# EAGLE schematic vldp-hw-rev03 (EAGLE 6.6.0)

## Sheet 1 of 4
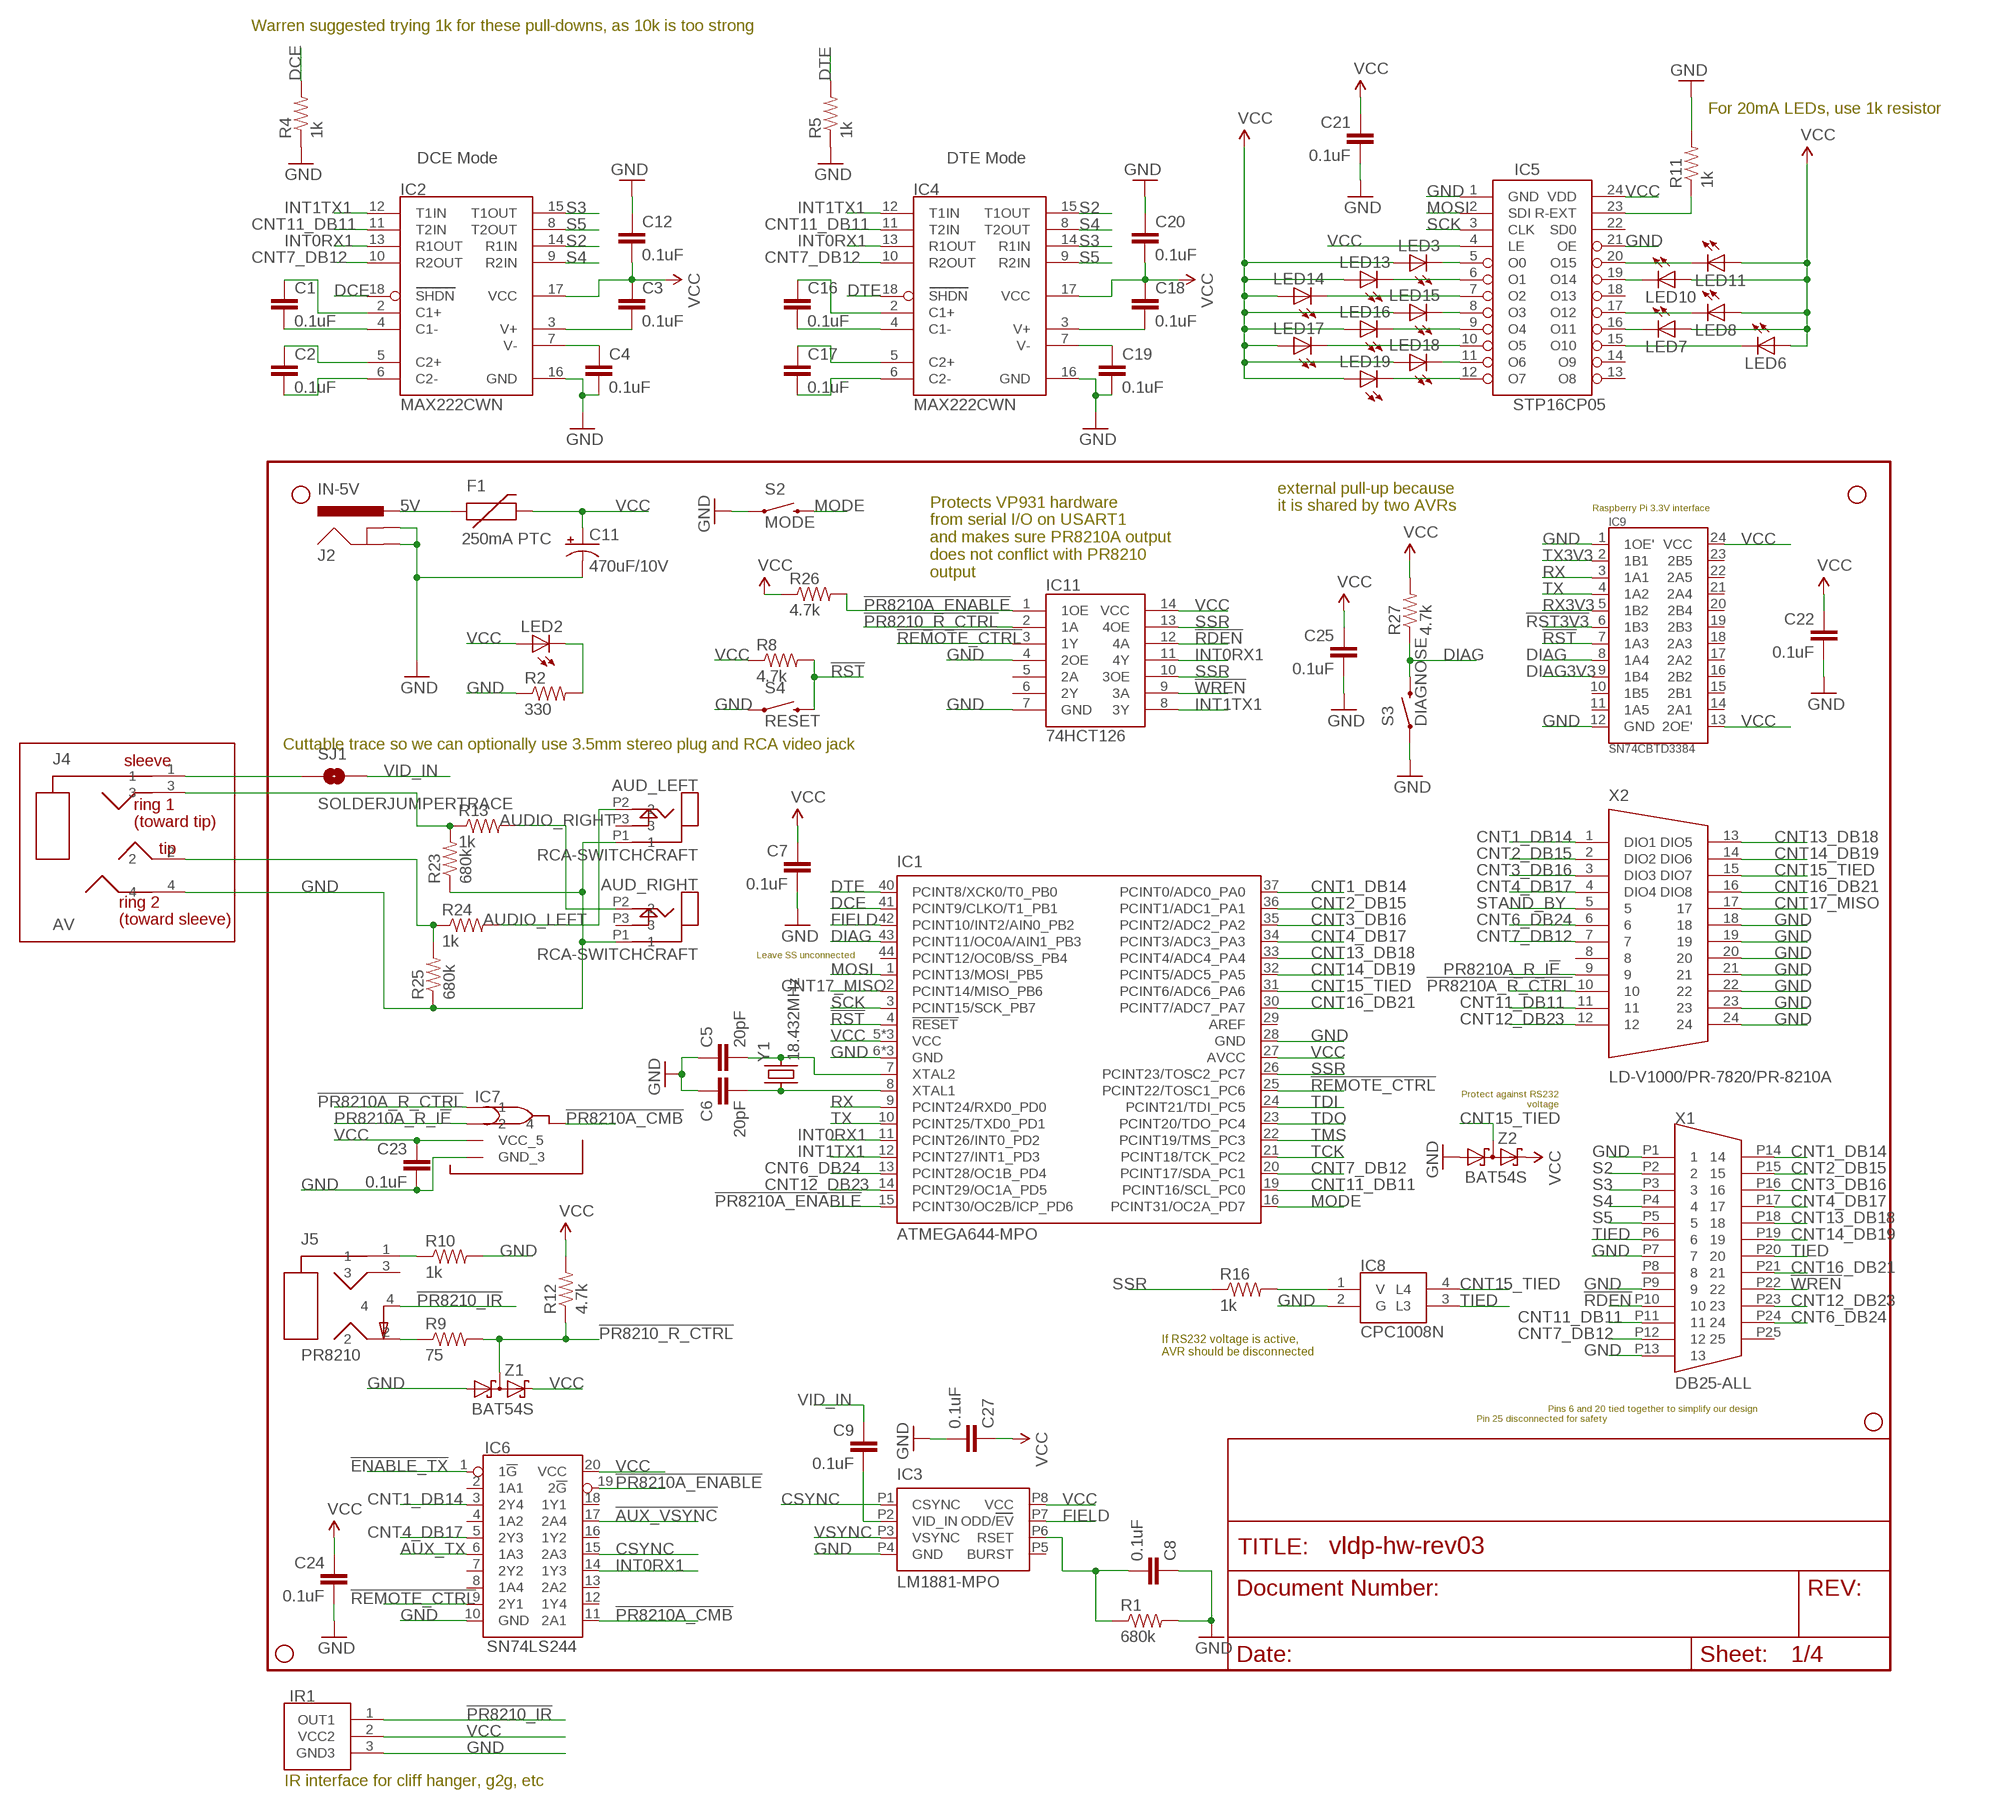
[diagram p0: schematic, sheet 1]

### Parts
AUD_LEFT  RCA-SWITCHCRAFT  [RCA-SWITCHCRAFT-4X]
AUD_RIGHT  RCA-SWITCHCRAFT  [RCA-SWITCHCRAFT-4X]
C1  0.1uF  CAP1206  [1206]
C2  0.1uF  CAP1206  [1206]
C3  0.1uF  CAP1206  [1206]
C4  0.1uF  CAP1206  [1206]
C5  20pF  CAP1206  [1206]
C6  20pF  CAP1206  [1206]
C7  0.1uF  CAP1206  [1206]
C8  0.1uF  CAP1206  [1206]
C9  0.1uF  CAP1206  [1206]
C11  470uF/10V  CAP_POLPTH2  [CPOL-RADIAL-10UF-25V]
C12  0.1uF  CAP1206  [1206]
C16  0.1uF  CAP1206  [1206]
C17  0.1uF  CAP1206  [1206]
C18  0.1uF  CAP1206  [1206]
C19  0.1uF  CAP1206  [1206]
C20  0.1uF  CAP1206  [1206]
C21  0.1uF  CAP1206  [1206]
C22  0.1uF  CAP1206  [1206]
C23  0.1uF  CAP1206  [1206]
C24  0.1uF  CAP1206  [1206]
C25  0.1uF  CAP1206  [1206]
C27  0.1uF  CAP1206  [1206]
F1  250mA PTC  PTCPTH  [PTC]
IC1  ATMEGA644-MPO  [TQFP44]
IC2  MAX222CWN  [SO18]
IC3  LM1881-MPO  [LM1881M]
IC4  MAX222CWN  [SO18]
IC5  STP16CP05  STP16CP05TSSOP24  [TSSOP24]
IC6  SN74LS244  [TSSOP20-MPO]
IC7  PR8210A_RMT  OR_GATE_2INPUT  [TSSOP5]
IC8  CPC1008N  [CPC1008N]
IC9  SN74CBTD3384  [TSSOP24]
IC11  74HCT126  [TSSOP14-MPO]
IR1  TSOP2438  [VISHAY]
J2  IN-5V  POWER_JACKPTH  [POWER_JACK_PTH]
J4  AV  3.5MM-4-TERMINALS  [3.5MM-SJ-43514]
J5  PR8210  3.5MM-STEREO-WITH-TIP-SWITCH  [3.5MM-SJ1-3554NG]
JP1  STAND-OFF  [STAND-OFF]
JP2  STAND-OFF  [STAND-OFF]
JP3  STAND-OFF  [STAND-OFF]
JP4  STAND-OFF  [STAND-OFF]
LED2  LED1206  [LED-1206]
LED3  LED1206  [LED-1206]
LED6  LED1206  [LED-1206]
LED7  LED1206  [LED-1206]
LED8  LED1206  [LED-1206]
LED10  LED1206  [LED-1206]
LED11  LED1206  [LED-1206]
LED13  LED1206  [LED-1206]
LED14  LED1206  [LED-1206]
LED15  LED1206  [LED-1206]
LED16  LED1206  [LED-1206]
LED17  LED1206  [LED-1206]
LED18  LED1206  [LED-1206]
LED19  LED1206  [LED-1206]
R1  680k  RESISTOR1206  [1206]
R2  330  RESISTOR1206  [1206]
R4  1k  RESISTOR1206  [1206]
R5  1k  RESISTOR1206  [1206]
R8  4.7k  RESISTOR1206  [1206]
R9  75  RESISTOR1206  [1206]
R10  1k  RESISTOR1206  [1206]
R11  1k  RESISTOR1206  [1206]
R12  4.7k  RESISTOR1206  [1206]
R13  1k  RESISTOR1206  [1206]
R16  1k  RESISTOR1206  [1206]
R23  680k  RESISTOR1206  [1206]
R24  1k  RESISTOR1206  [1206]
R25  680k  RESISTOR1206  [1206]
R26  4.7k  RESISTOR1206  [1206]
R27  4.7k  RESISTOR1206  [1206]
S2  MODE  SWITCH-MOMENTARY-2PTH  [TACTILE-PTH]
S3  DIAGNOSE  SWITCH-MOMENTARY-2PTH  [TACTILE-PTH]
S4  RESET  SWITCH-MOMENTARY-2PTH  [TACTILE-PTH]
SJ1  SOLDERJUMPERTRACE  [SJ_2S-TRACE]
X1  DB25-ALL  A32077-ND  [A32077-ND]
X2  LD-V1000/PR-7820/PR-8210A  111-024-213L001RIGHTANGLE  [112-YYY-213R001]
Y1  18.432MHz  CRYSTAL  [CRYSTAL-CSM-3X]
Z1  BAT54S  [SOT23]
Z2  BAT54S  [SOT23]

### Nets
5V: F1.P$1 J2.PWR ; also sheet 3
!AUX_VSYNC: IC6.17(2A4) ; also sheet 2,3
!ENABLE_TX: IC6.1(1!G) ; also sheet 2
!PR8210_IR: IR1.1(OUT1) J5.4
!PR8210_R_CTRL: IC11.2(1A) R9.2 R12.1 Z1.3(C1A2)
!PR8210A_CMB: IC6.11(2A1) IC7.P$4
!PR8210A_ENABLE: IC1.15(PCINT30/OC2B/ICP_PD6) IC6.19(2!G) IC11.1(1OE) R26.2
!PR8210A_R_CTRL: IC7.P$1 X2.10
!RDEN: IC11.12(4A) X1.P10
!REMOTE_CTRL: IC1.25(PCINT22/TOSC1_PC6) IC6.9(2Y1) IC11.3(1Y)
!RST: IC1.4(!RESET) IC9.7(1A3) R8.2 S4.3 ; also sheet 2,3
!RST3V3: IC9.6(1B3) ; also sheet 3
!WREN: IC11.9(3A) X1.P22
AUDIO_LEFT: AUD_LEFT.P2 R24.2 ; also sheet 3
AUDIO_RIGHT: AUD_RIGHT.P2 R13.2 ; also sheet 3
AUX_TX: IC6.6(1A3) ; also sheet 2
CNT1_DB14: IC1.37(PCINT0/ADC0_PA0) IC6.3(2Y4) X1.P14 X2.1(DIO1)
CNT2_DB15: IC1.36(PCINT1/ADC1_PA1) X1.P15 X2.2(DIO2)
CNT3_DB16: IC1.35(PCINT2/ADC2_PA2) X1.P16 X2.3(DIO3)
CNT4_DB17: IC1.34(PCINT3/ADC3_PA3) IC6.5(2Y3) X1.P17 X2.4(DIO4)
CNT6_DB24: IC1.13(PCINT28/OC1B_PD4) X1.P24 X2.6 ; also sheet 2,3
CNT7_DB12: IC1.20(PCINT17/SDA_PC1) IC2.10(R2OUT) IC4.10(R2OUT) X1.P12 X2.7
CNT11_DB11: IC1.19(PCINT16/SCL_PC0) IC2.11(T2IN) IC4.11(T2IN) X1.P11 X2.11 ; also sheet 2,3
CNT12_DB23: IC1.14(PCINT29/OC1A_PD5) X1.P23 X2.12 ; also sheet 2,3
CNT13_DB18: IC1.33(PCINT4/ADC4_PA4) X1.P18 X2.13(DIO5)
CNT14_DB19: IC1.32(PCINT5/ADC5_PA5) X1.P19 X2.14(DIO6)
CNT15_TIED: IC1.31(PCINT6/ADC6_PA6) IC8.4(L4) X2.15(DIO7) Z2.3(C1A2)
CNT16_DB21: IC1.30(PCINT7/ADC7_PA7) X1.P21 X2.16(DIO8)
CNT17_MISO: IC1.2(PCINT14/MISO_PB6) X2.17 ; also sheet 3
CSYNC: IC3.P1(CSYNC) IC6.15(2A3) ; also sheet 2,3
DCE: IC1.41(PCINT9/CLKO/T1_PB1) IC2.18(SHDN) R4.2 ; also sheet 2
DIAG: IC1.43(PCINT11/OC0A/AIN1_PB3) IC9.8(1A4) R27.1 S3.3 ; also sheet 2,3
DIAG3V3: IC9.9(1B4) ; also sheet 3
DTE: IC1.40(PCINT8/XCK0/T0_PB0) IC4.18(SHDN) R5.2 ; also sheet 2
FIELD: IC1.42(PCINT10/INT2/AIN0_PB2) IC3.P7(ODD/EV) ; also sheet 2,3
GND: AUD_LEFT.P1 AUD_RIGHT.P1 C4.2 C5.1 C6.1 C7.2 C8.1 C11.2(-) C12.1 C19.2 C20.1 C21.2 C22.2 C23.2 C24.2 C25.2 C27.2 IC1.6(GND) IC1.18(GND) IC1.28(GND) IC1.39(GND) IC2.16(GND) IC3.P4(GND) IC4.16(GND) IC5.1(GND) IC5.21(OE) IC6.10(GND) IC7.P$3(GND_3) IC8.2(G) IC9.1(1OE') IC9.12(GND) IC11.4(2OE) IC11.7(GND) IR1.3(GND3) J2.GND J2.GNDBREAK J4.4 R1.2 R2.1 R4.1 R5.1 R10.2 R11.2 R23.1 R25.1 S2.1 S3.1 S4.1 X1.P1 X1.P7 X1.P9 X1.P13 X2.18 X2.19 X2.20 X2.21 X2.22 X2.23 X2.24 Z1.1(A1) Z2.1(A1) ; also sheet 2,3
INT0RX1: IC1.11(PCINT26/INT0_PD2) IC2.13(R1OUT) IC4.13(R1OUT) IC6.14(1Y3) IC11.11(4Y) ; also sheet 3
INT1TX1: IC1.12(PCINT27/INT1_PD3) IC2.12(T1IN) IC4.12(T1IN) IC11.8(3Y) ; also sheet 2,3
MODE: IC1.16(PCINT31/OC2A_PD7) S2.3
MOSI: IC1.1(PCINT13/MOSI_PB5) IC5.2(SDI) ; also sheet 3
N$2: C2.1 IC2.5(C2+)
N$3: C5.2 IC1.7(XTAL2) Y1.P$2
N$4: C6.2 IC1.8(XTAL1) Y1.P$1
N$5: C1.2 IC2.4(C1-)
N$6: C1.1 IC2.2(C1+)
N$7: IC8.1(V) R16.2
N$8: C2.2 IC2.6(C2-)
N$9: C16.2 IC4.4(C1-)
N$10: J5.1 R10.1
N$11: C8.2 IC3.P6(RSET) R1.1
N$13: C9.2 IC3.P2(VID_IN)
N$16: LED2.C R2.2
N$18: J4.1 SJ1.1
N$21: J4.2 R24.1 R25.2
N$22: IC5.5(O0) LED3.C
N$23: IC5.6(O1) LED13.C
N$24: IC5.7(O2) LED14.C
N$25: IC5.8(O3) LED15.C
N$26: C16.1 IC4.2(C1+)
N$27: C17.1 IC4.5(C2+)
N$28: C17.2 IC4.6(C2-)
N$29: IC5.9(O4) LED16.C
N$30: IC5.10(O5) LED17.C
N$31: IC5.11(O6) LED18.C
N$32: IC5.12(O7) LED19.C
N$33: J4.3 R13.1 R23.2
N$35: IC5.15(O10) LED6.C
N$36: IC5.16(O11) LED7.C
N$37: IC5.17(O12) LED8.C
N$39: IC5.19(O14) LED10.C
N$40: IC5.20(O15) LED11.C
N$41: IC5.23(R-EXT) R11.1
PR8210_TIP: J5.2 R9.1
PR8210A_R_I!E: IC7.P$2 X2.9
RX: IC1.9(PCINT24/RXD0_PD0) IC9.3(1A1) ; also sheet 3
RX3V3: IC9.5(1B2) ; also sheet 3
S2: IC2.14(R1IN) IC4.15(T1OUT) X1.P2
S3: IC2.15(T1OUT) IC4.14(R1IN) X1.P3
S4: IC2.9(R2IN) IC4.8(T2OUT) X1.P4
S5: IC2.8(T2OUT) IC4.9(R2IN) X1.P5
SCK: IC1.3(PCINT15/SCK_PB7) IC5.3(CLK) ; also sheet 3
SSR: IC1.26(PCINT23/TOSC2_PC7) IC11.10(3OE) IC11.13(4OE) R16.1 ; also sheet 2
STAND_BY: X2.5 ; also sheet 2,3
TCK: IC1.21(PCINT18/TCK_PC2) ; also sheet 3
TDI: IC1.24(PCINT21/TDI_PC5) ; also sheet 3
TDO: IC1.23(PCINT20/TDO_PC4) ; also sheet 3
TIED: IC8.3(L3) X1.P6 X1.P20
TMS: IC1.22(PCINT19/TMS_PC3) ; also sheet 3
TX: IC1.10(PCINT25/TXD0_PD1) IC9.4(1A2) ; also sheet 3
TX3V3: IC9.2(1B1) ; also sheet 3
V+1: C3.2 IC2.3(V+)
V+2: C18.2 IC4.3(V+)
V-1: C4.1 IC2.7(V-)
V-2: C19.1 IC4.7(V-)
VCC: C3.1 C7.1 C11.1(+) C12.2 C18.1 C20.2 C21.1 C22.1 C23.1 C24.1 C25.1 C27.1 F1.P$2 IC1.5(VCC) IC1.17(VCC) IC1.27(AVCC) IC1.38(VCC) IC2.17(VCC) IC3.P8(VCC) IC4.17(VCC) IC5.4(LE) IC5.24(VDD) IC6.20(VCC) IC7.P$5(VCC_5) IC9.13(2OE') IC9.24(VCC) IC11.14(VCC) IR1.2(VCC2) LED2.A LED3.A LED6.A LED7.A LED8.A LED10.A LED11.A LED13.A LED14.A LED15.A LED16.A LED17.A LED18.A LED19.A R8.1 R12.2 R26.1 R27.2 Z1.2(C2) Z2.2(C2) ; also sheet 2,3
VID_IN: C9.1 SJ1.2 ; also sheet 2
VSYNC: IC3.P3(VSYNC) ; also sheet 3
Unconnected: AUD_LEFT.P3 AUD_RIGHT.P3 IC1.29(AREF) IC1.44(PCINT12/OC0B/SS_PB4) IC3.P5(BURST) IC5.13(O8) IC5.14(O9) IC5.18(O13) IC5.22(SD0) IC6.2(1A1) IC6.4(1A2) IC6.7(2Y2) IC6.8(1A4) IC6.12(1Y4) IC6.13(2A2) IC6.16(1Y2) IC6.18(1Y1) IC9.10(1B5) IC9.11(1A5) IC9.14(2A1) IC9.15(2B1) IC9.16(2B2) IC9.17(2A2) IC9.18(2A3) IC9.19(2B3) IC9.20(2B4) IC9.21(2A4) IC9.22(2A5) IC9.23(2B5) IC11.5(2A) IC11.6(2Y) J5.3 X1.P8 X1.P25 X2.8

### Notes on the sheet
- Warren suggested trying 1k for these pull-downs, as 10k is too strong
- For 20mA LEDs, use 1k resistor
- DCE Mode | DTE Mode
- external pull-up because
  it is shared by two AVRs
- Raspberry Pi 3.3V interface
- Protects VP931 hardware
  from serial I/O on USART1
  and makes sure PR8210A output
  does not conflict with PR8210
  output
- Cuttable trace so we can optionally use 3.5mm stereo plug and RCA video jack
- Leave SS unconnected
- Protect against RS232
  voltage
- If RS232 voltage is active,
  AVR should be disconnected
- Pins 6 and 20 tied together to simplify our design
- Pin 25 disconnected for safety
- IR interface for cliff hanger, g2g, etc

## Sheet 2 of 4
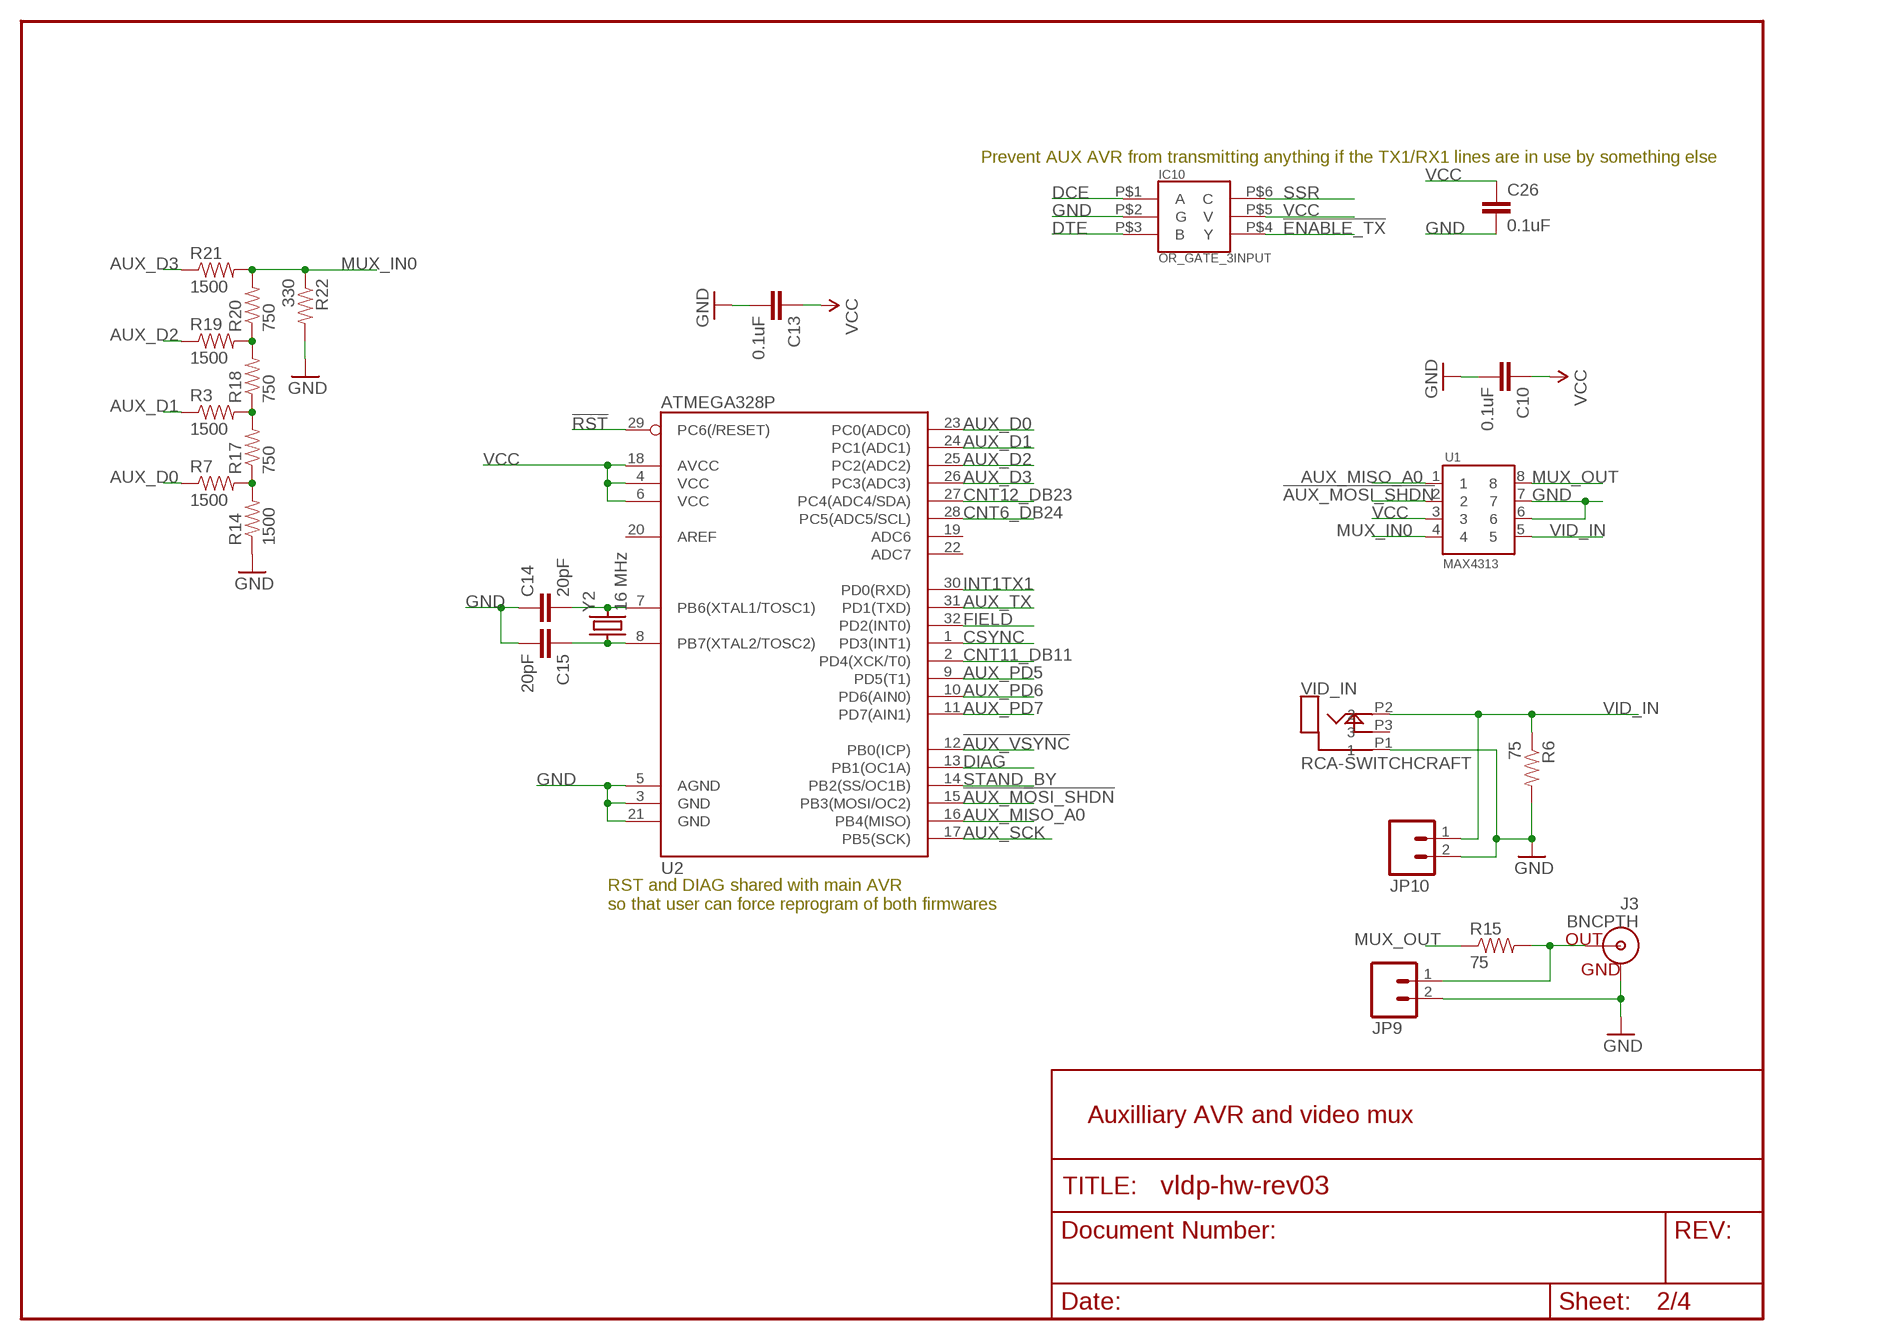
[diagram p1: schematic, sheet 2]

### Parts
C10  0.1uF  CAP1206  [1206]
C13  0.1uF  CAP1206  [1206]
C14  20pF  CAP1206  [1206]
C15  20pF  CAP1206  [1206]
C26  0.1uF  CAP1206  [1206]
IC10  OR_GATE_3INPUT  [TSSOP6-DCK]
J3  BNCPTH  [BNC]
JP9  M02PTH  [1X02]
JP10  M02PTH  [1X02]
R3  1500  RESISTOR1206  [1206]
R6  75  RESISTOR1206  [1206]
R7  1500  RESISTOR1206  [1206]
R14  1500  RESISTOR1206  [1206]
R15  75  RESISTOR1206  [1206]
R17  750  RESISTOR1206  [1206]
R18  750  RESISTOR1206  [1206]
R19  1500  RESISTOR1206  [1206]
R20  750  RESISTOR1206  [1206]
R21  1500  RESISTOR1206  [1206]
R22  330  RESISTOR1206  [1206]
U1  MAX4313  MAX4313UMAX  [MAXIM-UMAX-LONGPADS]
U2  ATMEGA328P  ATMEGA168  [TQFP32-LONGPADS]
VID_IN  RCA-SWITCHCRAFT  [RCA-SWITCHCRAFT-4X]
Y2  16 MHz  CRYSTAL  [CRYSTAL-CSM-3X]

### Nets
!AUX_MOSI_SHDN: U1.2 U2.15(PB3(MOSI/OC2)) ; also sheet 3
!AUX_VSYNC: U2.12(PB0(ICP)) ; also sheet 1,3
!ENABLE_TX: IC10.P$4(Y) ; also sheet 1
!RST: U2.29(PC6(/RESET)) ; also sheet 1,3
AUX_D0: R7.1 U2.23(PC0(ADC0))
AUX_D1: R3.1 U2.24(PC1(ADC1))
AUX_D2: R19.1 U2.25(PC2(ADC2))
AUX_D3: R21.1 U2.26(PC3(ADC3))
AUX_MISO_A0: U1.1 U2.16(PB4(MISO)) ; also sheet 3
AUX_PD5: U2.9(PD5(T1)) ; also sheet 3
AUX_PD6: U2.10(PD6(AIN0)) ; also sheet 3
AUX_PD7: U2.11(PD7(AIN1)) ; also sheet 3
AUX_SCK: U2.17(PB5(SCK)) ; also sheet 3
AUX_TX: U2.31(PD1(TXD)) ; also sheet 1
CNT6_DB24: U2.28(PC5(ADC5/SCL)) ; also sheet 1,3
CNT11_DB11: U2.2(PD4(XCK/T0)) ; also sheet 1,3
CNT12_DB23: U2.27(PC4(ADC4/SDA)) ; also sheet 1,3
CSYNC: U2.1(PD3(INT1)) ; also sheet 1,3
DCE: IC10.P$1(A) ; also sheet 1
DIAG: U2.13(PB1(OC1A)) ; also sheet 1,3
DTE: IC10.P$3(B) ; also sheet 1
FIELD: U2.32(PD2(INT0)) ; also sheet 1,3
GND: C10.2 C13.2 C14.1 C15.2 C26.2 IC10.P$2(G) J3.GND JP9.2 JP10.2 R6.2 R14.1 R22.2 U1.6 U1.7 U2.3(GND) U2.5(AGND) U2.21(GND) VID_IN.P1 ; also sheet 1,3
INT1TX1: U2.30(PD0(RXD)) ; also sheet 1,3
MUX_IN0: R20.2 R21.2 R22.1 U1.4
MUX_OUT: R15.1 U1.8
N$1: J3.S(OUT) JP9.1 R15.2
N$12: R3.2 R17.2 R18.1
N$14: R7.2 R14.2 R17.1
N$15: R18.2 R19.2 R20.1
N$17: C14.2 U2.7(PB6(XTAL1/TOSC1)) Y2.P$2
N$19: C15.1 U2.8(PB7(XTAL2/TOSC2)) Y2.P$1
SSR: IC10.P$6(C) ; also sheet 1
STAND_BY: U2.14(PB2(SS/OC1B)) ; also sheet 1,3
VCC: C10.1 C13.1 C26.1 IC10.P$5(V) U1.3 U2.4(VCC) U2.6(VCC) U2.18(AVCC) ; also sheet 1,3
VID_IN: JP10.1 R6.1 U1.5 VID_IN.P2 ; also sheet 1
Unconnected: U2.19(ADC6) U2.20(AREF) U2.22(ADC7) VID_IN.P3

### Notes on the sheet
- Prevent AUX AVR from transmitting anything if the TX1/RX1 lines are in use by something else
- RST and DIAG shared with main AVR
  so that user can force reprogram of both firmwares
- Auxilliary AVR and video mux

## Sheet 3 of 4
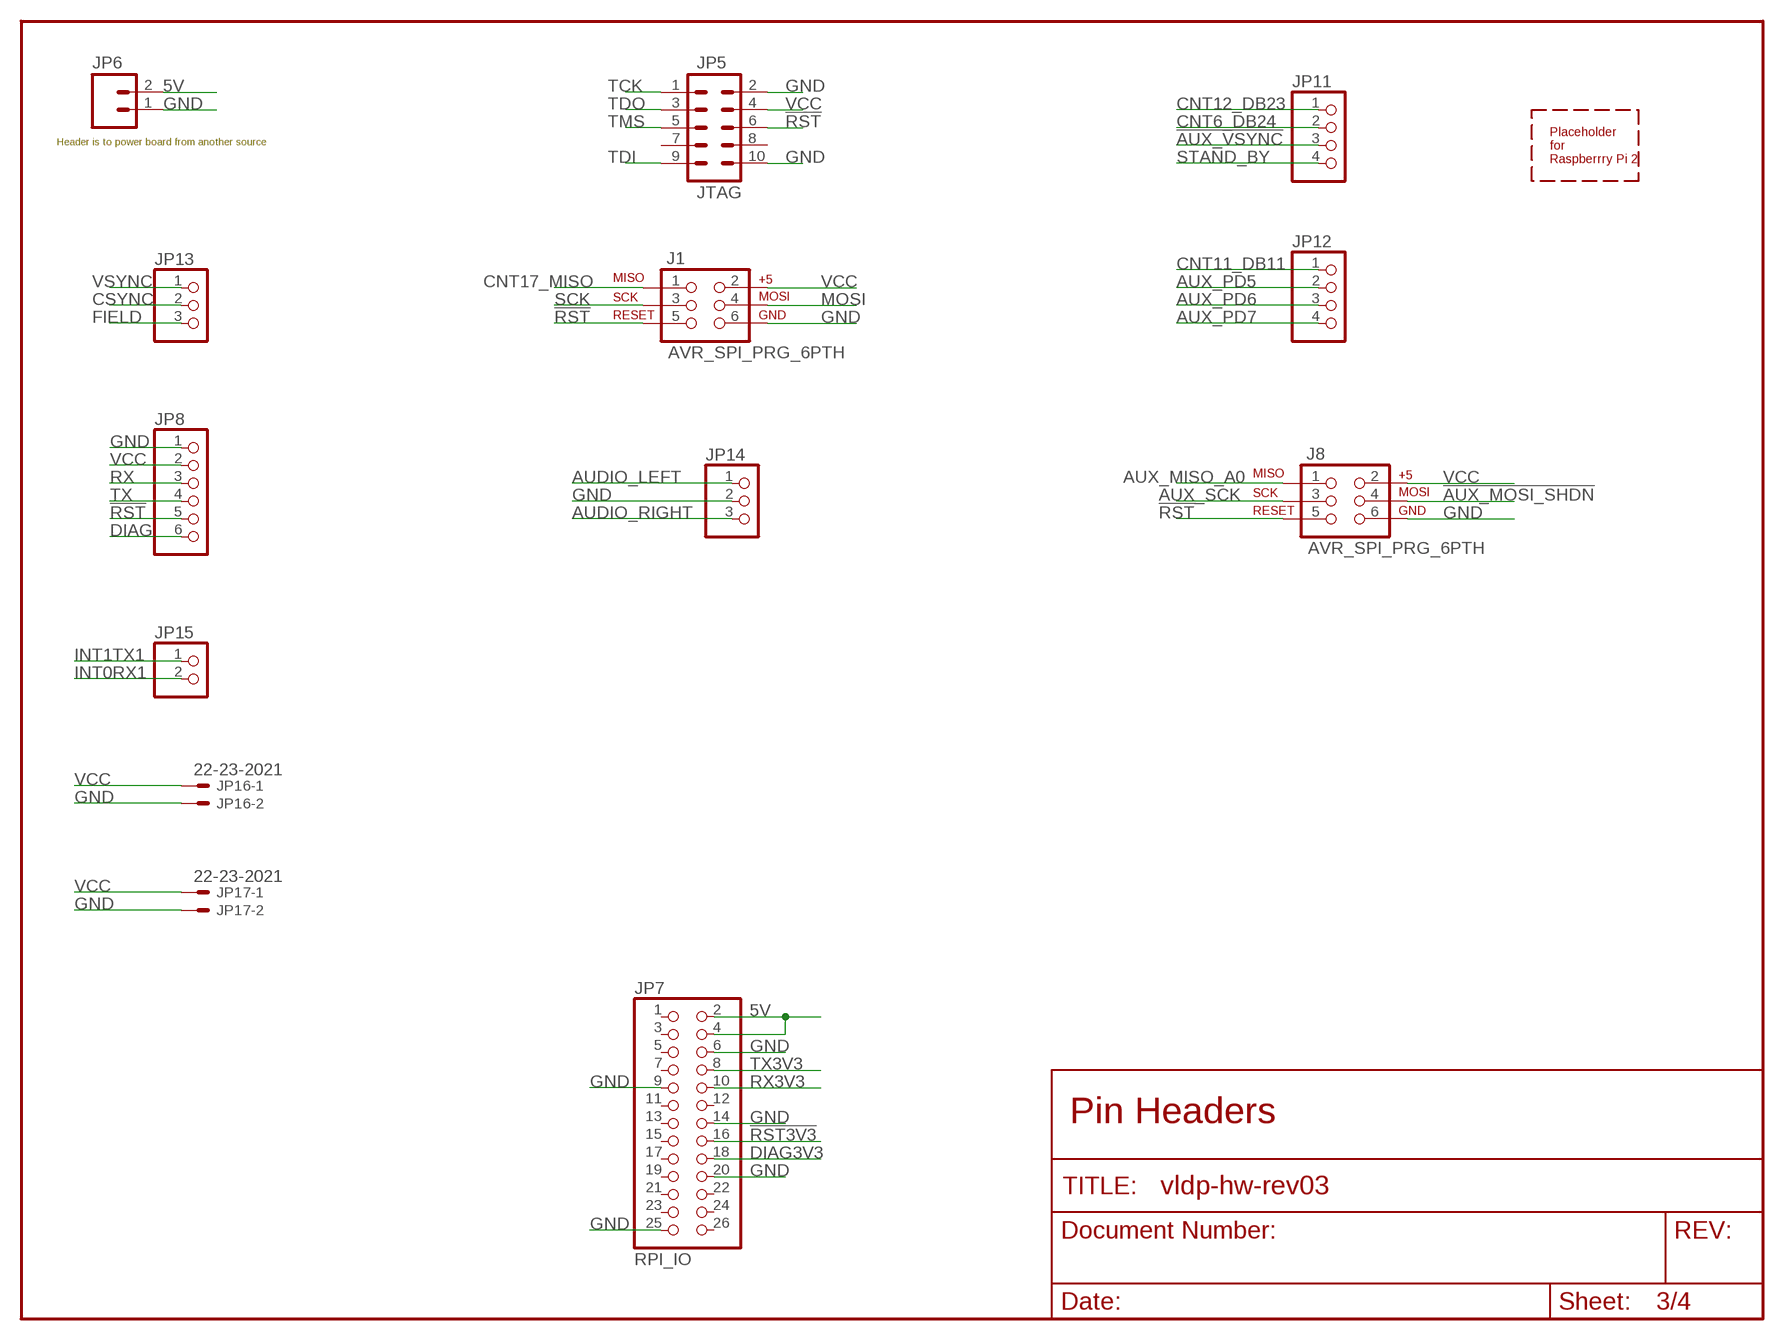
[diagram p2: schematic, sheet 3]

### Parts
J1  AVR_SPI_PRG_6PTH  [2X3]
J8  AVR_SPI_PRG_6PTH  [2X3]
JP5  JTAG  M05X2PTH  [AVR_ICSP]
JP6  M02PTH  [1X02]
JP7  RPI_IO  PINHD-2X13  [2X13]
JP8  PINHD-1X6  [1X06]
JP11  PINHD-1X4  [1X04]
JP12  PINHD-1X4  [1X04]
JP13  PINHD-1X3  [1X03]
JP14  PINHD-1X3  [1X03]
JP15  PINHD-1X2  [1X02]
JP16  22-23-2021  [22-23-2021]
JP17  22-23-2021  [22-23-2021]
U$1  RASPBERRY_PI2_LAYOUT  [RPI2]

### Nets
5V: JP6.2 JP7.2 JP7.4 ; also sheet 1
!AUX_MOSI_SHDN: J8.4 ; also sheet 2
!AUX_VSYNC: JP11.3 ; also sheet 1,2
!RST: J1.5 J8.5 JP5.6 JP8.5 ; also sheet 1,2
!RST3V3: JP7.16 ; also sheet 1
AUDIO_LEFT: JP14.1 ; also sheet 1
AUDIO_RIGHT: JP14.3 ; also sheet 1
AUX_MISO_A0: J8.1 ; also sheet 2
AUX_PD5: JP12.2 ; also sheet 2
AUX_PD6: JP12.3 ; also sheet 2
AUX_PD7: JP12.4 ; also sheet 2
AUX_SCK: J8.3 ; also sheet 2
CNT6_DB24: JP11.2 ; also sheet 1,2
CNT11_DB11: JP12.1 ; also sheet 1,2
CNT12_DB23: JP11.1 ; also sheet 1,2
CNT17_MISO: J1.1 ; also sheet 1
CSYNC: JP13.2 ; also sheet 1,2
DIAG: JP8.6 ; also sheet 1,2
DIAG3V3: JP7.18 ; also sheet 1
FIELD: JP13.3 ; also sheet 1,2
GND: J1.6 J8.6 JP5.2 JP5.10 JP6.1 JP7.6 JP7.9 JP7.14 JP7.20 JP7.25 JP8.1 JP14.2 JP16.2 JP17.2 ; also sheet 1,2
INT0RX1: JP15.2 ; also sheet 1
INT1TX1: JP15.1 ; also sheet 1,2
MOSI: J1.4 ; also sheet 1
RX: JP8.3 ; also sheet 1
RX3V3: JP7.10 ; also sheet 1
SCK: J1.3 ; also sheet 1
STAND_BY: JP11.4 ; also sheet 1,2
TCK: JP5.1 ; also sheet 1
TDI: JP5.9 ; also sheet 1
TDO: JP5.3 ; also sheet 1
TMS: JP5.5 ; also sheet 1
TX: JP8.4 ; also sheet 1
TX3V3: JP7.8 ; also sheet 1
VCC: J1.2 J8.2 JP5.4 JP8.2 JP16.1 JP17.1 ; also sheet 1,2
VSYNC: JP13.1 ; also sheet 1
Unconnected: JP5.7 JP5.8 JP7.1 JP7.3 JP7.5 JP7.7 JP7.11 JP7.12 JP7.13 JP7.15 JP7.17 JP7.19 JP7.21 JP7.22 JP7.23 JP7.24 JP7.26

### Notes on the sheet
- Header is to power board from another source
- Pin Headers

## Sheet 4 of 4

## Library data of the parts
AUD_LEFT AUD_RIGHT VID_IN = mpo:RCA-SWITCHCRAFT
C1-C10 C12-C27 = SparkFun:CAP: Capacitor Standard 0603 ceramic capacitor, and 0.1" leaded capacitor.
C11 = SparkFun:CAP_POL: Capacitor Polarized These are standard SMD and PTH capacitors. Normally 10uF, 47uF, and 100uF in electrolytic and tantalum varieties. Always verify the external diameter of the through hole cap, it varies with capacity, voltage, and manufacturer. The EIA devices should be standard.
F1 = SparkFun:PTC: Resettable Fuse PTC Resettable Fuse. Spark Fun Electronics SKU : COM-08357
IC1 = mpo:ATMEGA644-MPO
IC2 IC4 = mpo:MAX222CWN: MAX222CWN
IC3 = mpo:LM1881-MPO
IC5 = mpo:STP16CP05
IC6 = mpo:SN74LS244
IC7 = mpo:OR_GATE_2INPUT
IC8 = mpo:CPC1008N: CPC1008N
IC9 = mpo:SN74CBTD3384
IC10 = mpo:OR_GATE_3INPUT
IC11 = mpo:74HCT126
IR1 = mpo:TSOP2438
J1 J8 = SparkFun:AVR_SPI_PRG_6: AVR ISP 6 Pin This is the reduced ISP connector for AVR programming. Common on Arduino. This footprint will take up less PCB space and can be used with a 10-pin to 6-pin adapter such as SKU: BOB-08508
J2 = SparkFun:POWER_JACK: Power Jack This is the standard 5.5mm barrel jack for power. The PTH is the most common, proven, reliable, footprint. All others are experimental. The Slot footprint only works if the mill layer is transmitted to the PCB fab house so be warned. Spark Fun Electronics SKU : PRT-00119. Mating wall wart : TOL-00298 (and others)
J3 = SparkFun:BNC: BNC Connector, Mouser Part# 5227161
J4 = mpo:3.5MM-4-TERMINALS
J5 = mpo:3.5MM-STEREO-WITH-TIP-SWITCH
JP1-JP4 = SparkFun:STAND-OFF: Stand Off This is the mechanical footprint for a #4 phillips button head screw. Use the keepout ring to avoid running the screw head into surrounding components. SKU : PRT-00447
JP5 = SparkFun:M05X2: Header 5x2 Standard 10-pin dual row 0.1" header. Commonly used with AVR-ISP. Use with Spark Fun Electronics SKU: PRT-00778
JP6 JP9 JP10 = SparkFun:M02: Header 2 Standard 2-pin 0.1" header. Use with straight break away headers (SKU : PRT-00116), right angle break away headers (PRT-00553), swiss pins (PRT-00743), machine pins (PRT-00117), and female headers (PRT-00115). Molex polarized connector foot print use with SKU : PRT-08233 with associated crimp pins and housings.
JP7 = pinhead:PINHD-2X13: PIN HEADER
JP8 = pinhead:PINHD-1X6: PIN HEADER
JP11 JP12 = pinhead:PINHD-1X4: PIN HEADER
JP13 JP14 = pinhead:PINHD-1X3: PIN HEADER
JP15 = pinhead:PINHD-1X2: PIN HEADER
JP16 JP17 = con-molex:22-23-2021: .100" (2.54mm) Center Header - 2 Pin; MF: MOLEX; MPN: 22-23-2021; OC_FARNELL: 1462926; OC_NEWARK: 25C3832
LED2 LED3 LED6-LED8 LED10 LED11 LED13-LED19 = SparkFun:LED: LEDs Standard schematic elements and footprints for 5mm, 3mm, 1206, and 0603 sized LEDs. 5mm - Spark Fun Electronics SKU : COM-00529 (and others)
R1-R27 = SparkFun:RESISTOR: Resistor Basic schematic elements and footprints for 0603, 1206, and PTH resistors.
S2-S4 = SparkFun:SWITCH-MOMENTARY-2
SJ1 = SparkFun:SOLDERJUMPER: Solder Jumper Standard SMD solder jumper. Used to automate production. Two varients : Normally Open and Normally Closed are the same, but have different paste layers. NC will have a large amount of paste and should jumper during reflow.
U1 = mpo:MAX4313
U2 = mpo:ATMEGA168
U$1 = mpo:RASPBERRY_PI2_LAYOUT
X1 = mpo:A32077-ND: DB2 female right-angle Digikey A32077-ND
X2 = mpo:111-024-213L001: LD-V1000 connector
Y1 Y2 = mpo:CRYSTAL
Z1 Z2 = diode:BAT54S: Schottky Diodes Pin connection corrected 2011-05-04 Source: Fairchild .. BAT54.pdf